# EAGLE design Pi-Kuehler (EAGLE 7.4.0)
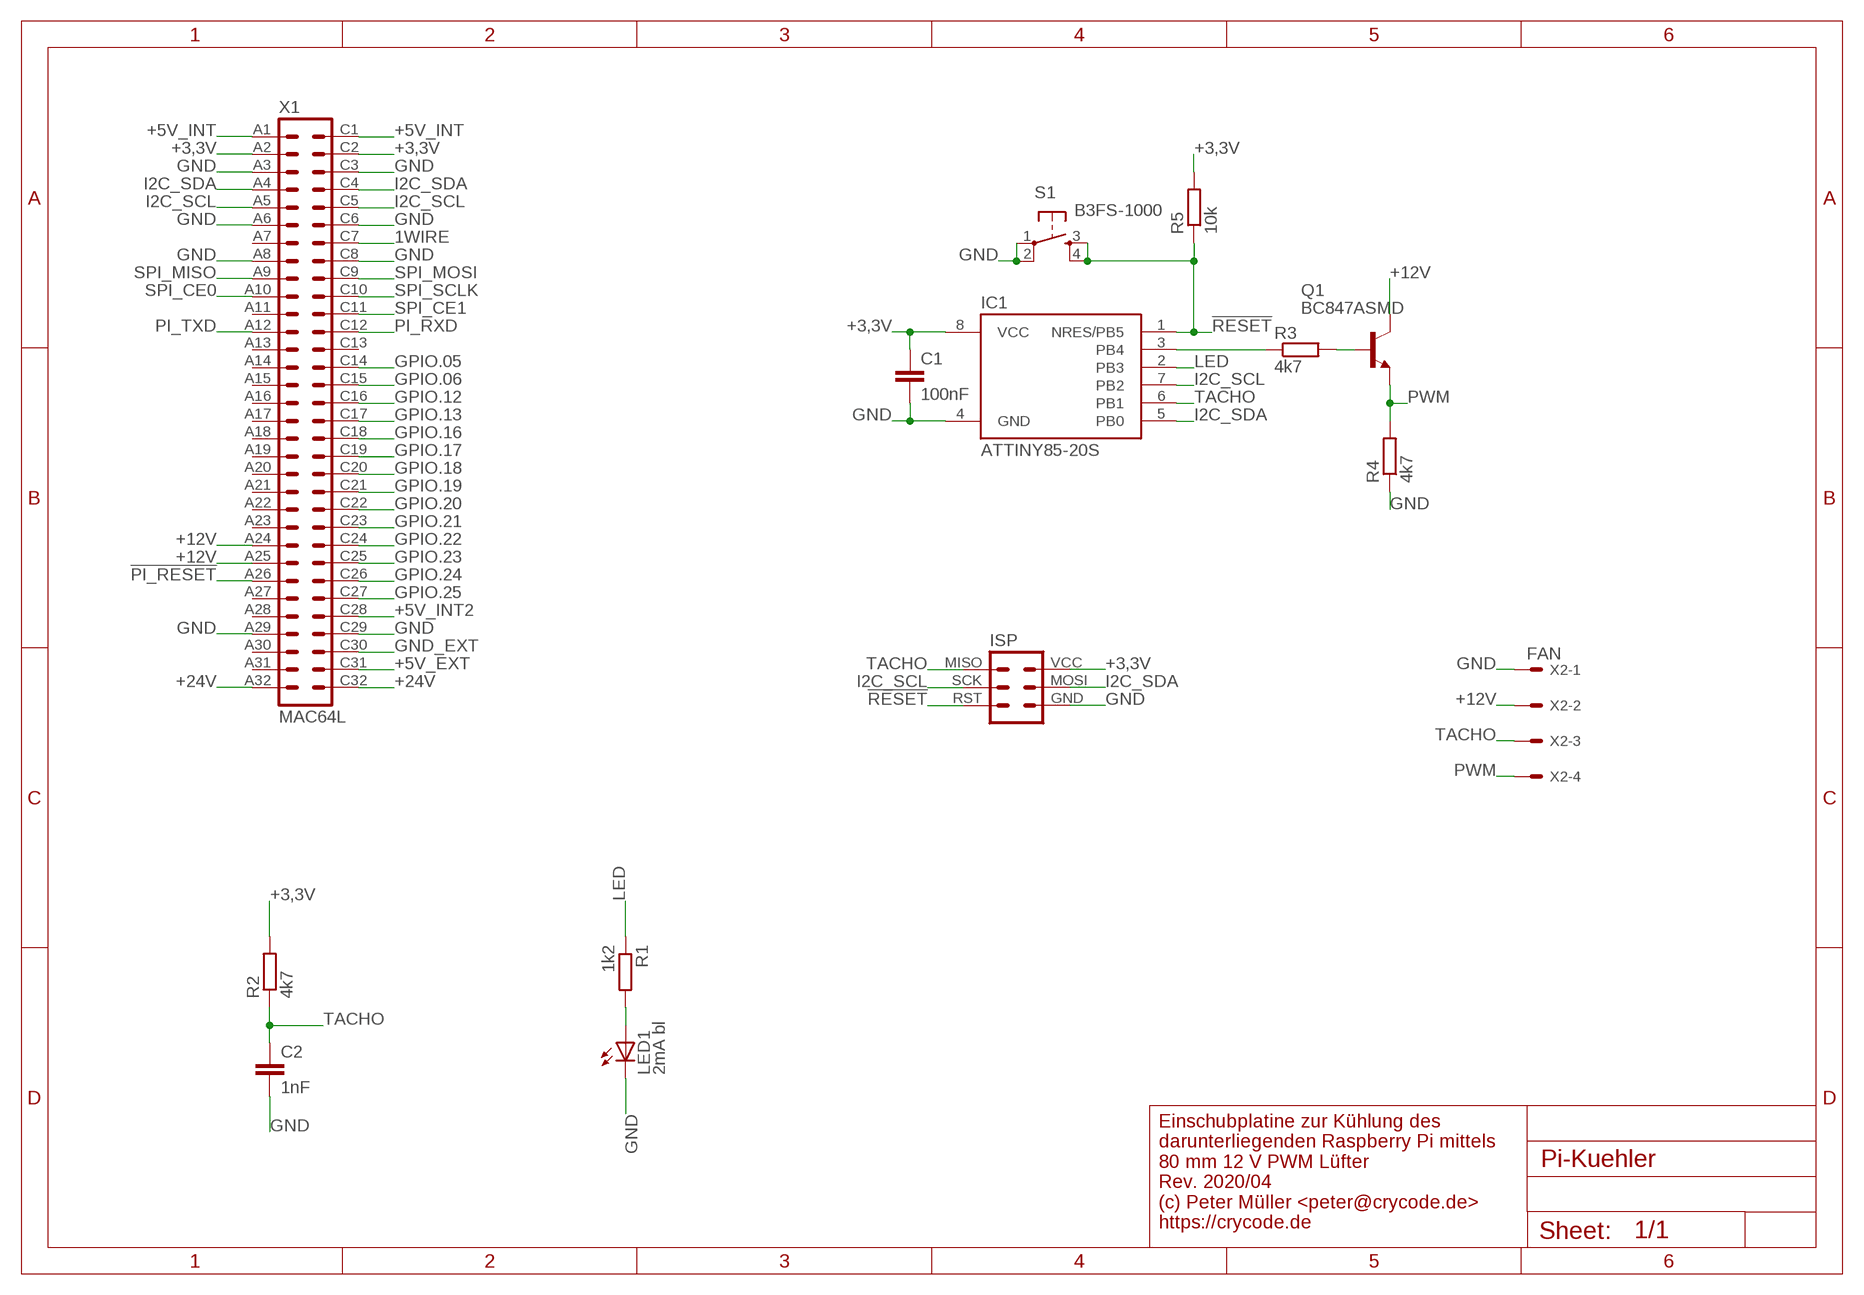
[diagram p0: schematic, sheet 1]

## Parts
C1  100nF  C-EUC1206  [C1206]
C2  1nF  C-EUC1206  [C1206]
IC1  ATTINY85-20S  [SOIC8_EIAJ_208MIL]
ISP  ISPVIAS-ONLY-1.27MM  [ISP-VIAS-ONLY-1.27MM]
LED1  2mA bl  LEDCHIPLED_1206  [CHIPLED_1206]
Q1  BC847ASMD  [SOT23]
R1  1k2  R-EU_R1206  [R1206]
R2  4k7  R-EU_R1206  [R1206]
R3  4k7  R-EU_R1206  [R1206]
R4  4k7  R-EU_R1206  [R1206]
R5  10k  R-EU_R1206  [R1206]
S1  B3FS-1000  [B3FS-1000]
X1  MAC64L  [MAC64L]
X2  FAN  22-27-2041-04  [6410-04]

## Nets
1WIRE: X1.C7
!PI_RESET: X1.A26
!RESET: IC1.1(NRES/PB5) ISP.RST R5.1 S1.3(S) S1.4(S1)
+3,3V: C1.1 IC1.8(VCC) ISP.VCC R2.2 R5.2 X1.A2 X1.C2
+5V_EXT: X1.C31
+5V_INT: X1.A1 X1.C1
+5V_INT2: X1.C28
+12V: Q1.3(C) X1.A24 X1.A25 X2.2
+24V [24V]: X1.A32 X1.C32
GND: C1.2 C2.2 IC1.4(GND) ISP.GND LED1.C R4.1 S1.1(P) S1.2(P1) X1.A3 X1.A6 X1.A8 X1.A29 X1.C3 X1.C6 X1.C8 X1.C29 X2.1
GND_EXT: X1.C30
GPIO.05: X1.C14
GPIO.06: X1.C15
GPIO.12: X1.C16
GPIO.13: X1.C17
GPIO.16: X1.C18
GPIO.17: X1.C19
GPIO.18: X1.C20
GPIO.19: X1.C21
GPIO.20: X1.C22
GPIO.21: X1.C23
GPIO.22: X1.C24
GPIO.23: X1.C25
GPIO.24: X1.C26
GPIO.25: X1.C27
I2C_SCL: IC1.7(PB2) ISP.SCK X1.A5 X1.C5
I2C_SDA: IC1.5(PB0) ISP.MOSI X1.A4 X1.C4
LED: IC1.2(PB3) R1.1
N$1: IC1.3(PB4) R3.1
N$2: Q1.1(B) R3.2
N$15: LED1.A R1.2
PI_RXD: X1.C12
PI_TXD: X1.A12
PWM: Q1.2(E) R4.2 X2.4
SPI_CE0: X1.A10
SPI_CE1: X1.C11
SPI_MISO: X1.A9
SPI_MOSI: X1.C9
SPI_SCLK: X1.C10
TACHO: C2.1 IC1.6(PB1) ISP.MISO R2.1 X2.3
Unconnected: X1.A7 X1.A11 X1.A13 X1.A14 X1.A15 X1.A16 X1.A17 X1.A18 X1.A19 X1.A20 X1.A21 X1.A22 X1.A23 X1.A27 X1.A28 X1.A30 X1.A31 X1.C13

## Notes on the sheet
- Einschubplatine zur Kühlung des
  darunterliegenden Raspberry Pi mittels
  80 mm 12 V PWM Lüfter
  Rev. 2020/04
  (c) Peter Müller <peter@crycode.de>
  https://crycode.de

## Library data of the parts
C1 C2 = rcl:C-EU: CAPACITOR, European symbol
IC1 = attiny25_45_85:ATTINY85*: ATMEL ATtiny 85 Packages: P = PDIP 08 30mil S = SOIC 08 EIAJ 208mil Technologies Note: for complete ordering code (temp. range, finish, tape&reel etc.) see www.atmel.com • Supply Voltage: V = (1.8…5.5)V | [blank] = (2.7…5.5)V • Speed: 10 = 10 MHz | 20 = 20 MHz Author: Dipl.-Ing. FH Rainer Bayer HHN Hochschule Heilbronn (Heilbronn University), rainer.bayer@hs-heilbronn.de Ingenieurbüro ing-rb, mail@ing-rb.de
ISP = pogo-isp:ISP: ISP connector pads for Pogo ISP There are variants for mixed pads/vias, pads only and vias.
LED1 = led:LED: LED OSRAM: - CHIPLED LG R971, LG N971, LY N971, LG Q971, LY Q971, LO R971, LY R971 LH N974, LH R974 LS Q976, LO Q976, LY Q976 LO Q996 - Hyper CHIPLED LW Q18S LB Q993, LB Q99A, LB R99A - SideLED LS A670, LO A670, LY A670, LG A670, LP A670 LB A673, LV A673, LT A673, LW A673 LH A674 LY A675 LS A676, LA A676, LO A676, LY A676, LW A676 LS A679, LY A679, LG A679 - Hyper Micro SIDELED® LS Y876, LA Y876, LO Y876, LY Y876 LT Y87S - SmartLED LW L88C, LW L88S LB L89C, LB L89S, LG L890 LS L89K, LO L89K, LY L89K LS L896, LA L896, LO L896, LY L896 - TOPLED LS T670, LO T670, LY T670, LG T670, LP T670 LSG T670, LSP T670, LSY T670, LOP T670, LYG T670 LG T671, LOG T671, LSG T671 LB T673, LV T673, LT T673, LW T673 LH T674 LS T676, LA T676, LO T676, LY T676, LB T676, LH T676, LSB T676, LW T676 LB T67C, LV T67C, LT T67C, LS T67K, LO T67K, LY T67K, LW E67C LS E67B, LA E67B, LO E67B, LY E67B, LB E67C, LV E67C, LT E67C LW T67C LS T679, LY T679, LG T679 LS T770, LO T770, LY T770, LG T770, LP T770 LB T773, LV T773, LT T773, LW T773 LH T774 LS E675, LA E675, LY E675, LS T675 LS T776, LA T776, LO T776, LY T776, LB T776 LHGB T686 LT T68C, LB T68C - Hyper Mini TOPLED® LB M676 - Mini TOPLED Santana® LG M470 LS M47K, LO M47K, LY M47K Source: http://www.osram.convergy.de LUXEON: - LUMILED® LXK2-PW12-R00, LXK2-PW12-S00, LXK2-PW14-U00, LXK2-PW14-V00 LXK2-PM12-R00, LXK2-PM12-S00, LXK2-PM14-U00 LXK2-PE12-Q00, LXK2-PE12-R00, LXK2-PE12-S00, LXK2-PE14-T00, LXK2-PE14-U00 LXK2-PB12-K00, LXK2-PB12-L00, LXK2-PB12-M00, LXK2-PB14-N00, LXK2-PB14-P00, LXK2-PB14-Q00 LXK2-PR12-L00, LXK2-PR12-M00, LXK2-PR14-Q00, LXK2-PR14-R00 LXK2-PD12-Q00, LXK2-PD12-R00, LXK2-PD12-S00 LXK2-PH12-R00, LXK2-PH12-S00 LXK2-PL12-P00, LXK2-PL12-Q00, LXK2-PL12-R00 Source: www.luxeon.com KINGBRIGHT: KA-3528ASYC Source: www.kingbright.com
Q1 = transistor-npn:BC847*: NPN Transistor
R1-R5 = rcl:R-EU_: RESISTOR, European symbol
S1 = b3fs-1000:B3FS-1000
X1 = con-vg:MAC64L: CONNECTOR male, 64 pins, block, type C, rows AC, grid 5.08 mm
X2 = con-molex:22-?-04: CONNECTOR wire to board 2.54 mm (.1 inch) pitch header; OC_FARNELL: unknown; OC_NEWARK: unknown

## Net classes
1 24V: width 0.813 mm, clearance 0.406 mm

## Board
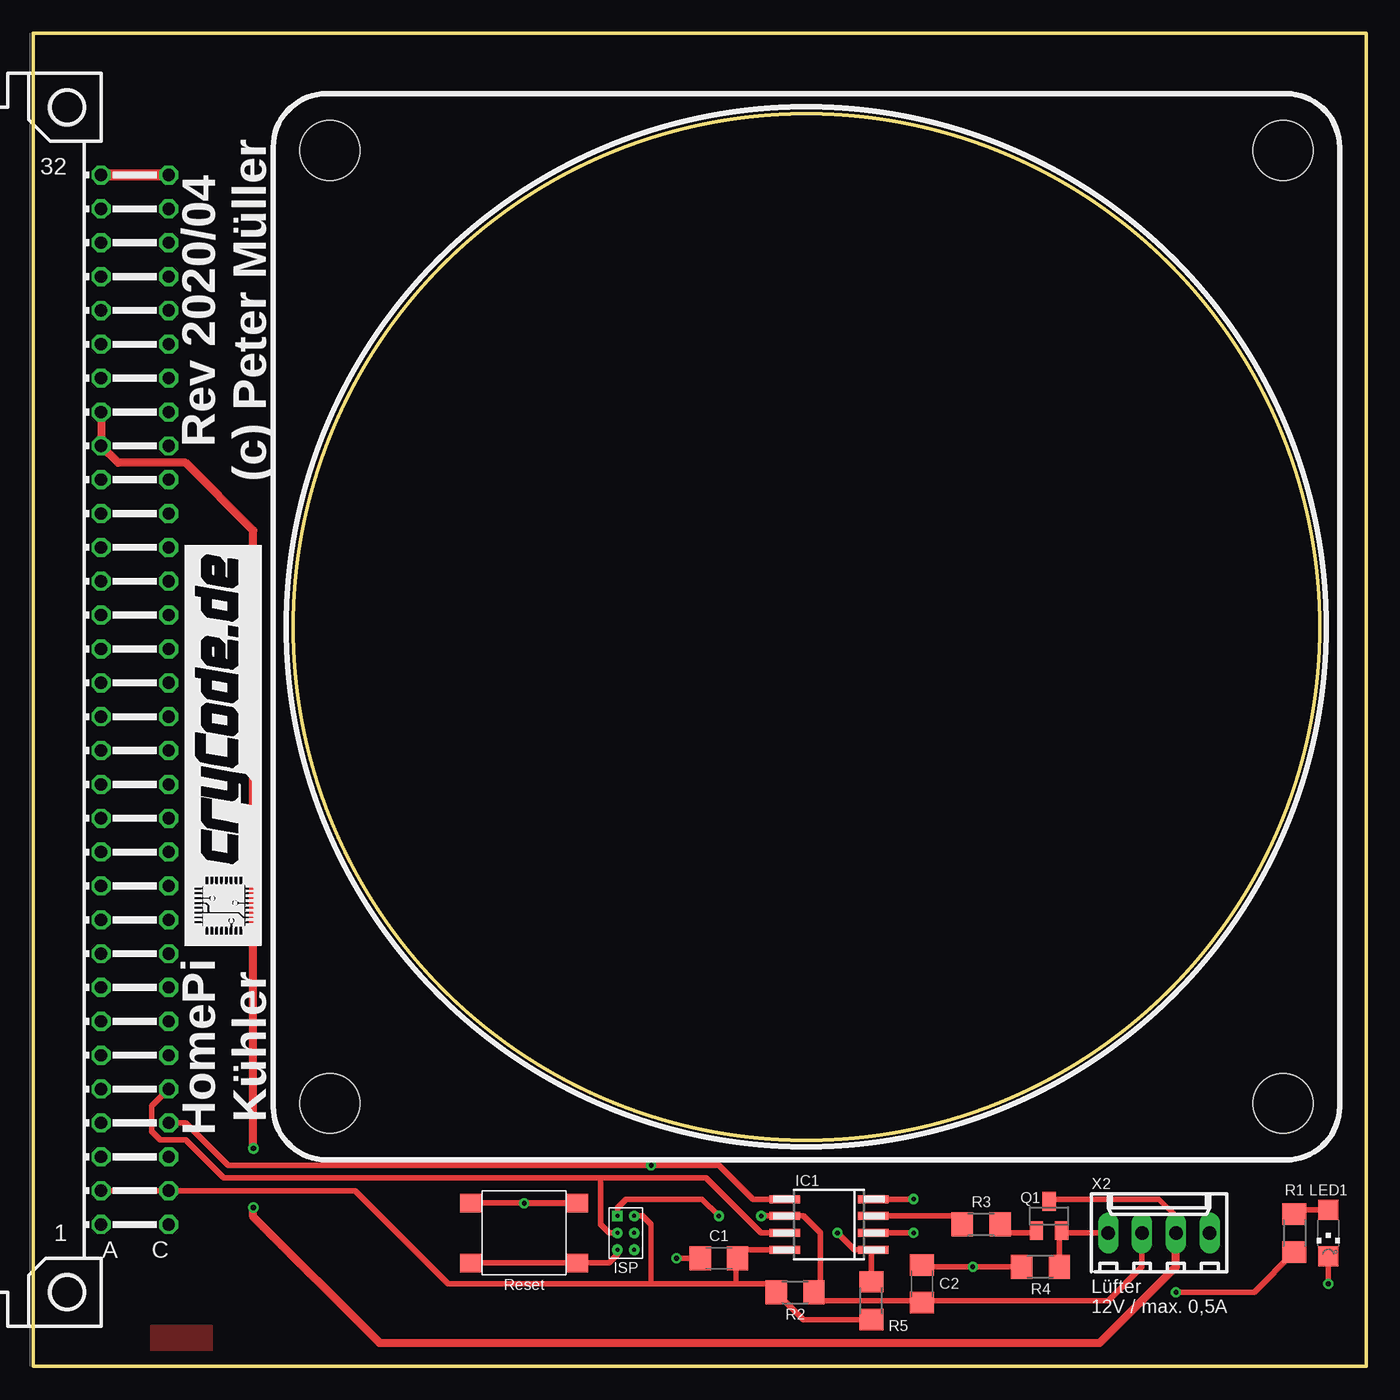
[diagram p1: board, top side]
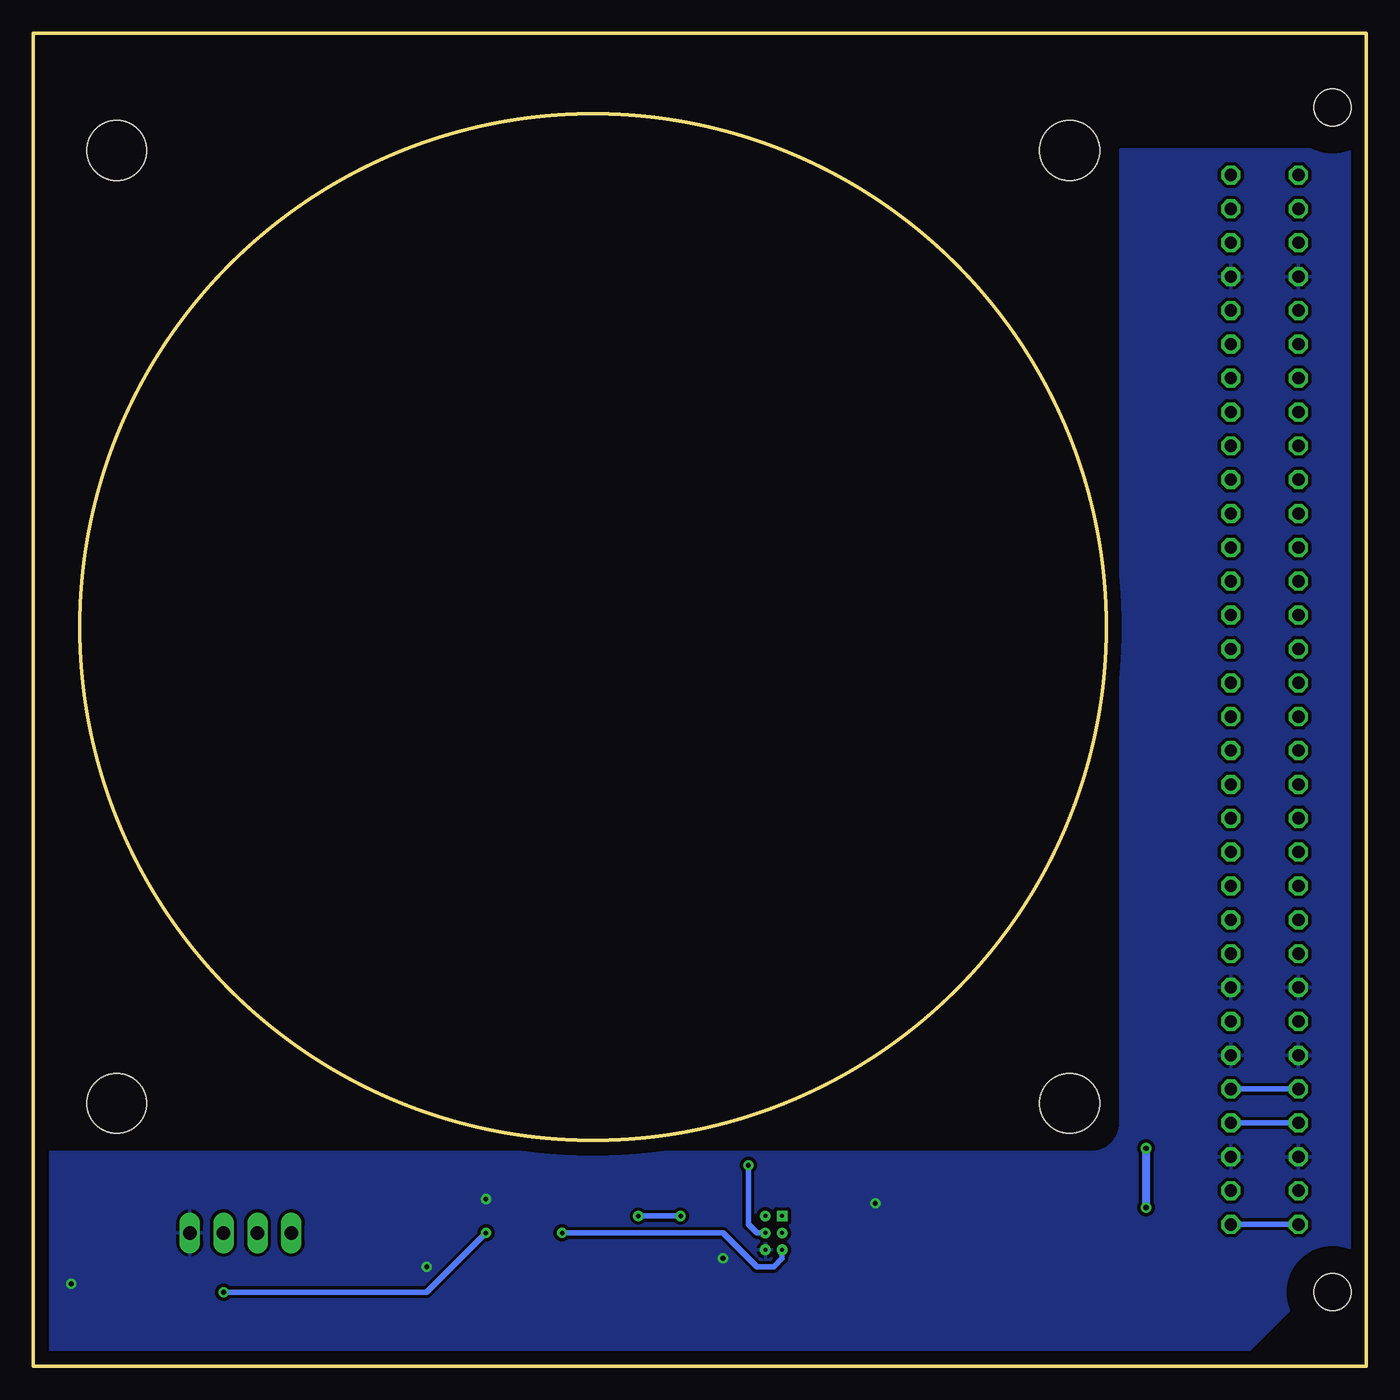
[diagram p2: board, bottom side, seen from below]

Size 100 x 100 mm. Coordinates in mm from the lower left corner, seen from the top.
Outline: 0,0 100,0 100,100 0,100 0,0
Outline: circle at 58,55.47 radius 38.5
Copper layers (1*16): Top 0.035mm / dielectric 1.5mm / Bottom 0.035mm
Design rules "allpcb2 *": minimum track width 8mil, minimum drill 0.3mm, track to track 8mil, track to pad 8mil, pad to pad 8mil, via to via 8mil, smd to smd 6mil, copper to edge 40mil, drill to drill 8mil, minimum pad ring 10mil, minimum via ring 8mil, stop-mask expansion 0.1mm, vias tented up to drill 1mm, thermal gap 10mil

### Footprints (pad centres in the part's own frame; a part is rotated, then mirrored left to right if it is on the bottom)
C1206 = smd 1.6 x 1.8: 1 -1.4,0; 2 1.4,0
SOIC8_EIAJ_208MIL = smd 0.6 x 2.286: 1 -1.905,-3.33; 2 -0.635,-3.33; 3 0.635,-3.33; 4 1.905,-3.33; 5 1.905,3.33; 6 0.635,3.33; 7 -0.635,3.33; 8 -1.905,3.33
ISP-VIAS-ONLY-1.27MM = drill 0.3 pad 0.762: GND 0.635,-1.27; MOSI 0.635,0; RST -0.635,-1.27; SCK -0.635,0; VCC 0.635,1.27 | drill 0.3 pad 0.762 square: MISO -0.635,1.27
CHIPLED_1206 = smd 1.5 x 1.5: A 0,-1.75; C 0,1.75
SOT23 = smd 1 x 1.4: 1 -0.95,-1.1; 2 0.95,-1.1; 3 0,1.1
R1206 = smd 1.6 x 1.803: 1 -1.422,0; 2 1.422,0
B3FS-1000 = smd 1.6 x 1.4: 1 4,-2.25; 2 -4,-2.25; 3 4,2.25; 4 -4,2.25
80MM = hole 4.5: -35.75,-35.75; 35.75,-35.75; 35.75,35.75; -35.75,35.75
MAC64L = drill 0.914 octagon: A1 -2.54,39.37; A2 -2.54,36.83; A3 -2.54,34.29; A4 -2.54,31.75; A5 -2.54,29.21; A6 -2.54,26.67; A7 -2.54,24.13; A8 -2.54,21.59; A9 -2.54,19.05; A10 -2.54,16.51; A11 -2.54,13.97; A12 -2.54,11.43; A13 -2.54,8.89; A14 -2.54,6.35; A15 -2.54,3.81; A16 -2.54,1.27; A17 -2.54,-1.27; A18 -2.54,-3.81; A19 -2.54,-6.35; A20 -2.54,-8.89; A21 -2.54,-11.43; A22 -2.54,-13.97; A23 -2.54,-16.51; A24 -2.54,-19.05; A25 -2.54,-21.59; A26 -2.54,-24.13; A27 -2.54,-26.67; A28 -2.54,-29.21; A29 -2.54,-31.75; A30 -2.54,-34.29; A31 -2.54,-36.83; A32 -2.54,-39.37; C1 -7.62,39.37; C2 -7.62,36.83; C3 -7.62,34.29; C4 -7.62,31.75; C5 -7.62,29.21; C6 -7.62,26.67; C7 -7.62,24.13; C8 -7.62,21.59; C9 -7.62,19.05; C10 -7.62,16.51; C11 -7.62,13.97; C12 -7.62,11.43; C13 -7.62,8.89; C14 -7.62,6.35; C15 -7.62,3.81; C16 -7.62,1.27; C17 -7.62,-1.27; C18 -7.62,-3.81; C19 -7.62,-6.35; C20 -7.62,-8.89; C21 -7.62,-11.43; C22 -7.62,-13.97; C23 -7.62,-16.51; C24 -7.62,-19.05; C25 -7.62,-21.59; C26 -7.62,-24.13; C27 -7.62,-26.67; C28 -7.62,-29.21; C29 -7.62,-31.75; C30 -7.62,-34.29; C31 -7.62,-36.83; C32 -7.62,-39.37 | hole 2.794: 0,44.45; 0,-44.45
6410-04 = drill 1.016 long: 1 3.81,0; 2 1.27,0; 3 -1.27,0; 4 -3.81,0

### Placement (x,y rotation side)
C1  51.44,8.09 180 top
C2  66.67,6.18 90 top
IC1  59.69,10.63 90 top
ISP  44.45,10 0 top
LED1  97.16,10 180 top
Q1  76.2,11.27 0 top
R1  94.61,10 90 top
R2  57.15,5.55 180 top
R3  71.12,10.63 0 top
R4  75.56,7.46 0 top
R5  62.87,4.92 270 top
S1  36.83,10 180 top
U$1  [30MM]  17.14,31.58 90 top
U$2  [80MM]  58,55.47 0 top
X1  2.54,50 180 top
X2  84.45,10 0 top

### Tracks (layer width: path | path; a pad name or v marks a point on that pad's centre or on a via)
!RESET  (via drill 0.35 pad 0.7)
  Top 0.406: R5.1 62.87,8.57 IC1.1 61.59,8.73 v60.33,10 | ISP.RST 43.81,8.41 43.18,7.77 40.86,7.77 S1.4 S1.3
  Bottom 0.406: v60.33,10 48.26,10 45.72,7.46 44.45,7.46 43.81,8.09 ISP.RST
+3,3V
  Top 0.406: IC1.8 53.47,8.73 C1.1 52.7,7.96 52.7,6.18 | 52.7,6.18 46.35,6.18 | 46.35,6.18 31.11,6.18 24.13,13.17 X1.C2 X1.A2 | 52.7,6.18 55.09,6.18 R2.2 57.78,3.49 R5.2 | ISP.VCC 45.72,11.27 46.35,10.63 46.35,6.18
+5V_INT
  Bottom 0.406: X1.A1 X1.C1
+12V  (via drill 0.4)
  Top 0.406: Q1.3 76.37,12.54 84.45,12.54 85.72,11.27 X2.2
  Top 0.61: X2.2 85.72,7.46 80.01,1.74 25.97,1.74 16.51,11.2 v16.51,11.9 | v16.51,16.34 16.51,62.7 11.43,67.78 6.35,67.78 X1.A24 X1.A25
  Bottom 0.61: v16.51,11.9 v16.51,16.34
+24V
  Top 0.813: X1.C32 X1.A32
GND  (via drill 0.35 pad 0.7)
  Top 0.406: S1.1 S1.2 40.8,12.22 v36.83,12.22 | C1.2 v48.26,8.09 | IC1.4 v66.04,12.54 | C2.2 66.81,7.46 v70.48,7.46 R4.1 | LED1.C v97.16,6.18
  pour Bottom (isolate 0.254): 8.89,1.1 99.06,1.1 99.06,16.03 20.64,16.03 arc-90 18.41,18.25 18.41,91.28 1.27,91.28 1.27,8.73
  pour Bottom: 8.89,3.01 13.34,3.01 13.34,1.1 8.89,1.1
I2C_SCL
  Top 0.406: IC1.7 54.61,10 50.48,14.12 42.55,14.12 | ISP.SCK 43.18,10 42.55,10.63 42.55,14.12 | 42.55,14.12 14.29,14.12 11.43,16.98 9.53,16.98 8.89,17.61 8.89,19.52 X1.C5
  Bottom 0.406: X1.C5 X1.A5
I2C_SDA  (via drill 0.35 pad 0.7)
  Top 0.406: IC1.5 53.98,12.54 51.44,15.08 v46.35,15.08 14.61,15.08 11.43,18.25 X1.C4
  Bottom 0.406: ISP.MOSI 45.72,10 46.35,10.63 v46.35,15.08 | X1.C4 X1.A4
LED  (via drill 0.35 pad 0.7)
  Top 0.406: IC1.2 v66.04,10 | v85.72,5.55 91.59,5.55 R1.1
  Bottom 0.406: v66.04,10 70.48,5.55 v85.72,5.55
N$1
  Top 0.406: IC1.3 69.22,11.27 69.7,10.78 R3.1
N$2
  Top 0.406: Q1.1 75.08,10 73.03,10 72.54,10.48 R3.2
N$15
  Top 0.406: R1.2 94.94,11.75 LED1.A
PWM
  Top 0.406: X2.4 77.32,10 Q1.2 76.99,10 R4.2
TACHO  (via drill 0.35 pad 0.7)
  Top 0.406: v54.61,11.27 IC1.6 57.78,11.27 59.05,10 59.05,6.18 58.57,5.7 R2.1 58.57,5.4 59.05,4.92 66.55,4.92 C2.1 66.81,4.92 80.64,4.92 83.19,7.46 X2.3 | v51.44,11.27 50.16,12.54 44.45,12.54 43.81,11.9 ISP.MISO
  Bottom 0.406: v54.61,11.27 v51.44,11.27
TOP
  pour Top: 8.89,3.01 13.34,3.01 13.34,1.1 8.89,1.1

### Text on the board
tNames: Rev 2020/04 / (c) Peter Müller | HomePi / Kühler | Reset | Lüfter / 12V / max. 0,5A
tRestrict: TOP
bRestrict: BOT